# Altium schematic sheet 1uF Cap.schdoc
size 127 x 101 mm
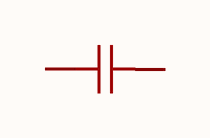
[diagram p0: 1uF Cap.schdoc]

## Parts
U?  1uF  [C0603]  (value not drawn)

## Nets

Not connected (* = marked no-connect by the designer): U? 1 2

## Library data of the parts
U? = CS1608Y5V105Z160NRB: Manufacturer: SAMWHA(三和); Add into BOM: yes; Tolerance: -20%~+80%; Symbol: CS1608Y5V105Z160NRB; Device: CS1608Y5V105Z160NRB; LCSC Part Name: 1uF -20%~+80% 16V; Supplier Part: C5189821; Manufacturer Part: CS1608Y5V105Z160NRB; Supplier Footprint: 0603; JLCPCB Part Class: Extended Part; Datasheet: https://atta.szlcsc.com/upload/public/pdf/source/20221012/139B9393213A50C271C48844AD3DF211.pdf; Supplier: LCSC; Convert to PCB: yes; Value: 1uF